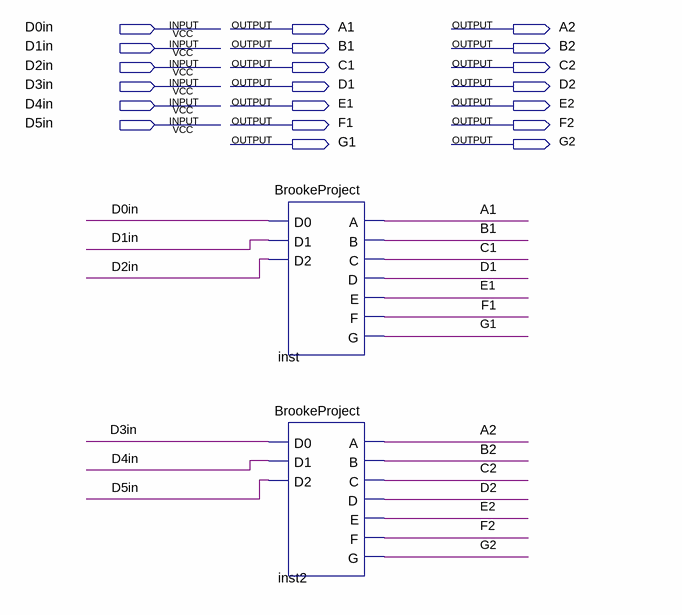
[diagram p0: schematic sheet]
// Quartus schematic MessageProject.bdf as structural Verilog: 2 symbols, 20 pins
module MessageProject (
  input  D0in,
  input  D1in,
  input  D2in,
  input  D3in,
  input  D4in,
  input  D5in,
  output A1,
  output A2,
  output B1,
  output B2,
  output C1,
  output C2,
  output D1,
  output D2,
  output E1,
  output E2,
  output F1,
  output F2,
  output G1,
  output G2
);

  BrookeProject inst (.D0(D0in), .D1(D1in), .D2(D2in), .A(A1), .B(B1), .C(C1), .D(D1), .E(E1), .F(F1), .G(G1));
  BrookeProject inst2 (.D0(D3in), .D1(D4in), .D2(D5in), .A(A2), .B(B2), .C(C2), .D(D2), .E(E2), .F(F2), .G(G2));
endmodule
